# Altium schematic sheet HighCurrentSwitch.SchDoc
size A4
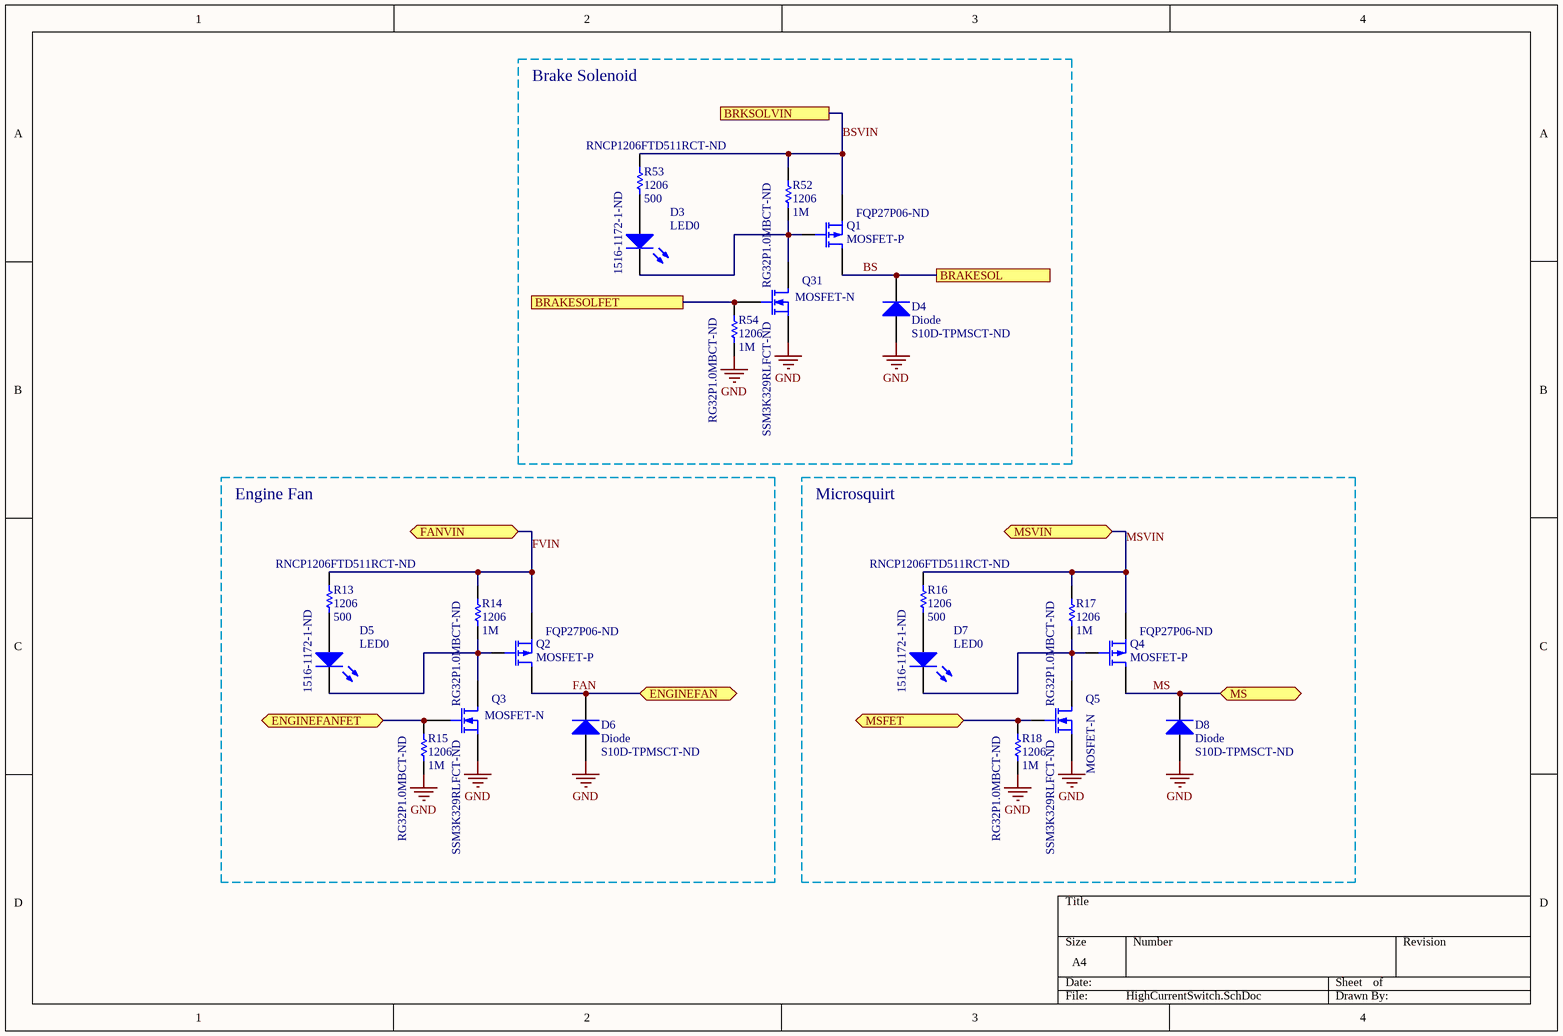
[diagram p0: HighCurrentSwitch.SchDoc]

## Parts
D3  LED0  Supplier Part Number 1: 1516-1172-1-ND  [C1206]
D4  Diode  Supplier Part Number 1: S10D-TPMSCT-ND  [S10D-TP]
D5  LED0  Supplier Part Number 1: 1516-1172-1-ND  [C1206]
D6  Diode  Supplier Part Number 1: S10D-TPMSCT-ND  [S10D-TP]
D7  LED0  Supplier Part Number 1: 1516-1172-1-ND  [C1206]
D8  Diode  Supplier Part Number 1: S10D-TPMSCT-ND  [S10D-TP]
Q1  MOSFET-P  Supplier Part Number 1: FQP27P06-ND  [TO-220]
Q2  MOSFET-P  Supplier Part Number 1: FQP27P06-ND  [TO-220]
Q3  MOSFET-N  Supplier Part Number 1: SSM3K329RLFCT-ND  [SOT23f]
Q4  MOSFET-P  Supplier Part Number 1: FQP27P06-ND  [TO-220]
Q5  MOSFET-N  Supplier Part Number 1: SSM3K329RLFCT-ND  [SOT23f]
Q31  MOSFET-N  Supplier Part Number 1: SSM3K329RLFCT-ND  [SOT23f]
R13  1206  value 500  Supplier Part Number 1: RNCP1206FTD511RCT-ND  [C1206]
R14  1206  value 1M  Supplier Part Number 1: RG32P1.0MBCT-ND  [1206 (High Density)]
R15  1206  value 1M  Supplier Part Number 1: RG32P1.0MBCT-ND  [1206 (High Density)]
R16  1206  value 500  Supplier Part Number 1: RNCP1206FTD511RCT-ND  [C1206]
R17  1206  value 1M  Supplier Part Number 1: RG32P1.0MBCT-ND  [1206 (High Density)]
R18  1206  value 1M  Supplier Part Number 1: RG32P1.0MBCT-ND  [1206 (High Density)]
R52  1206  value 1M  Supplier Part Number 1: RG32P1.0MBCT-ND  [1206 (High Density)]
R53  1206  value 500  Supplier Part Number 1: RNCP1206FTD511RCT-ND  [C1206]
R54  1206  value 1M  Supplier Part Number 1: RG32P1.0MBCT-ND  [1206 (High Density)]

## Blocks framed on the sheet
Brake Solenoid: D3 D4 Q1 Q31 R52-R54
Engine Fan: D5 D6 Q2 Q3 R13-R15
Microsquirt: D7 D8 Q4 Q5 R16-R18

## Ports
BRAKESOL, BRAKESOLFET, BRKSOLVIN, ENGINEFAN (bidir), ENGINEFANFET (bidir), FANVIN (bidir), MS (bidir), MSFET (bidir), MSVIN (bidir)

## Nets
GND: D4.1(A) D6.1(A) D8.1(A) Q3.3(S) Q5.3(S) Q31.3(S) R15.1 R18.1 R54.1
BRAKESOLFET: Q31.2(G) R54.2 ; port BRAKESOLFET
BS: D4.2(K) Q1.2(D) ; port BRAKESOL
BSVIN: Q1.3(S) R52.2 R53.1 ; port BRKSOLVIN
ENGINEFANFET: Q3.2(G) R15.2 ; port ENGINEFANFET
FAN: D6.2(K) Q2.2(D) ; port ENGINEFAN
FVIN: Q2.3(S) R13.1 R14.2 ; port FANVIN
MS: D8.2(K) Q4.2(D) ; port MS
MSFET: Q5.2(G) R18.2 ; port MSFET
MSVIN: Q4.3(S) R16.1 R17.2 ; port MSVIN
NetD3_1: D3.1(A) R53.2
NetD3_2: D3.2(K) Q1.1(G) Q31.1(D) R52.1
NetD5_1: D5.1(A) R13.2
NetD5_2: D5.2(K) Q2.1(G) Q3.1(D) R14.1
NetD7_1: D7.1(A) R16.2
NetD7_2: D7.2(K) Q4.1(G) Q5.1(D) R17.1

## Library data of the parts
D3 D5 D7 = LED0: Typical INFRARED GaAs LED; Published: 8-Jun-2000; LatestRevisionDate: 08-Jul-2005; LatestRevisionNote: Mech Layer 1 removed.; PackageReference: LED-0; Publisher: Altium Limited; PackageDescription: LED; 2 Leads; Supplier 1: Digi-Key
D4 D6 D8 = Diode: Default Diode; Published: 8-Jun-2000; LatestRevisionDate: 17-Jul-2002; LatestRevisionNote: Re-released for DXP Platform.; PackageVersion: Sep-1996; PackageReference: SMC; Publisher: Altium Limited; PackageDescription: DO-214-AB/SMC; 2 C-Bend Leads; Body 7.9 x 5.9 mm, inc. leads (LxW); Code_JEDEC: DO-214-AB; Supplier 1: Digi-Key
Q1 Q2 Q4 = MOSFET-P: P-Channel MOSFET; Published: 8-Jun-2000; LatestRevisionDate: 17-Jul-2002; LatestRevisionNote: Re-released for DXP Platform.; PackageVersion: 1995/1996; PackageReference: E3; Publisher: Altium Limited; PackageDescription: TO, Flat Index; 3 In-Line, Axial Leads; Body Dia. 4.6mm; Lead Dia. 0.5 mm (max); Supplier 1: Digi-Key
Q3 Q5 Q31 = MOSFET-N: N-Channel MOSFET; Published: 8-Jun-2000; LatestRevisionDate: 17-Jul-2002; LatestRevisionNote: Re-released for DXP Platform.; PackageVersion: 1995/1996; PackageReference: E3; Publisher: Altium Limited; PackageDescription: TO, Flat Index; 3 In-Line, Axial Leads; Body Dia. 4.6mm; Lead Dia. 0.5 mm (max); Supplier 1: Digi-Key
R13-R18 R53 R54 = Res1: Resistor; Published: 8-Jun-2000; LatestRevisionDate: 17-Jul-2002; LatestRevisionNote: Re-released for DXP Platform.; PackageReference: AXIAL-0.3; Publisher: Altium Limited; PackageDescription: Axial Device, Thru-Hole; 2 Leads; 0.3 in Pin Spacing; Supplier 1: Digi-Key
R52 = Res1: 1M Resistor; Published: 8-Jun-2000; LatestRevisionDate: 17-Jul-2002; LatestRevisionNote: Re-released for DXP Platform.; PackageReference: AXIAL-0.3; Publisher: Altium Limited; PackageDescription: Axial Device, Thru-Hole; 2 Leads; 0.3 in Pin Spacing; Supplier 1: Digi-Key